# Altium schematic sheet USB Sheet (FT232RL).SchDoc
size A4
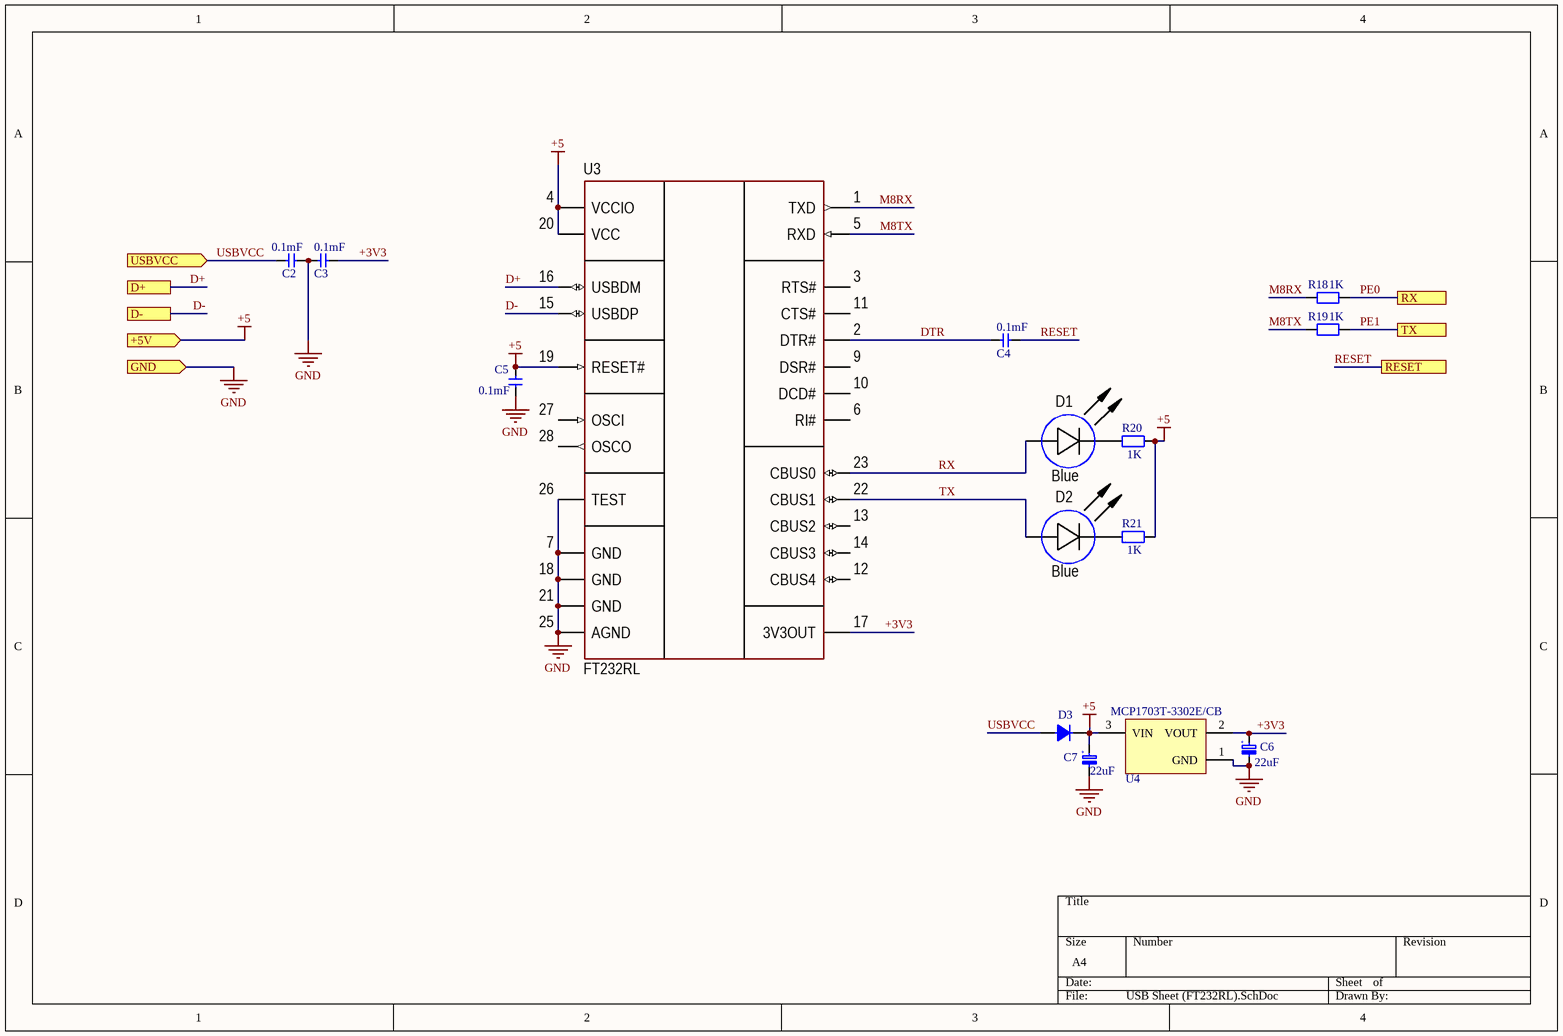
[diagram p0: USB Sheet (FT232RL).SchDoc]

## Parts
C2  0.1mF  [cap0603]
C3  0.1mF  [cap0603]
C4  0.1mF  [cap0603]
C5  0.1mF  [cap0603]
C6  22uF  [Tantal B]
C7  22uF  [Tantal B]
D1  Blue  [CH0805LB]
D2  Blue  [CH0805LB]
D3  Diode SMD  [SOD123]  (value not drawn)
R18  1K  [res0603]
R19  1K  [res0603]
R20  1K  [res0603]
R21  1K  [res0603]
U3  FT232RL  [28-SSOP]
U4  MCP1703T-3302E/CB  [SOT-23A-CB3_M]

## Ports
+5V (in), D+, D-, GND (in), RESET, RX, TX, USBVCC (in)

## Nets
+5: C5.2 C7.2(PLUS) D3.2 R20.2 R21.2 U3.4(VCCIO) U3.19(RESET#) U3.20(VCC) U4.3(VIN) ; port +5V
GND: C2.2 C3.1 C5.1 C6.1(MINUS) C7.1(MINUS) U3.7(GND) U3.18(GND) U3.21(GND) U3.25(AGND) U3.26(TEST) U4.1(GND) ; port GND
+3V3: C3.2 C6.2(PLUS) U3.17(3V3OUT) U4.2(VOUT)
D+: U3.16(USBDM) ; port D+
D-: U3.15(USBDP) ; port D-
DTR: C4.1 U3.2(DTR#)
M8RX: R18.1 U3.1(TXD)
M8TX: R19.1 U3.5(RXD)
PE0: R18.2 ; port RX
PE1: R19.2 ; port TX
RESET: C4.2 ; port RESET
RX: D1.1(A) U3.23(CBUS0)
TX: D2.1(A) U3.22(CBUS1)
USBVCC: C2.1 D3.1 ; port USBVCC
NetD1_2: D1.2(C) R20.1
NetD2_2: D2.2(C) R21.1

Not connected (* = marked no-connect by the designer): U3 3(RTS#) 6(RI#) 9(DSR#) 10(DCD#) 11(CTS#) 12(CBUS4) 13(CBUS2) 14(CBUS3) 27(OSCI) 28(OSCO)

## Notes on the sheet
- (in symbol Cap Tantal) +

## Library data of the parts
C2-C5 = Cap SMD
C6 C7 = Cap Tantal
D1 D2 = LED: Manufacturer: *; Model: *; HelpURL: *; ComponentKind: *; Value: *
R18-R21 = Resistor SMD
U3 = FT232RL: USB-UART; Manufacturer: FTDI, Future Technology Devices International Ltd; Model: FT232RL-REEL; HelpURL: https://www.digikey.com/product-detail/en/ftdi-future-technology-devices-international-ltd/FT232RL-REEL/768-1007-1-ND/1836402; ComponentKind: SSOP-28
U4 = MCP1703T-3302E/CB: 250 mA, 16V, Low Quiescent Current LDO Regulator, 3-Pin SOT-23A, Extended Temperature, Tape and Reel; Published: 29-Jan-2009; DatasheetVersion: revD, Sep-2009; PackageVersion: revBB, Aug-2009; PackageReference: SOT-23A-CB3; Publisher: Altium Limited; PackageDescription: 3-Lead Plastic Small Outline Transistor (CB) [SOT-23A]; Supplier 1: Digi-Key; Supplier Part Number 1: MCP1703T-3302E/CBTR-ND; Supplier 2: Digi-Key; Supplier Part Number 2: MCP1703T-3302E/CBCT-ND; Supplier 3: Digi-Key; Supplier Part Number 3: MCP1703T-3302E/CBDKR-ND; Supplier 4: Farnell; Supplier Part Number 4: 1439518; ComponentLink1Description: Datasheet; ComponentLink1URL: http://ww1.microchip.com/downloads/en/DeviceDoc/22049d.pdf; ComponentLink2Description: Packaging Specification; ComponentLink2URL: http://www.microchip.com/stellent/groups/techpub_sg/documents/packagingspec/en012702.pdf; ComponentLink3Description: Microchip.com Home; ComponentLink3URL: http://www.microchip.com/